# EAGLE schematic LightTable_Borders_CurrentMirror (EAGLE 9.6.2)
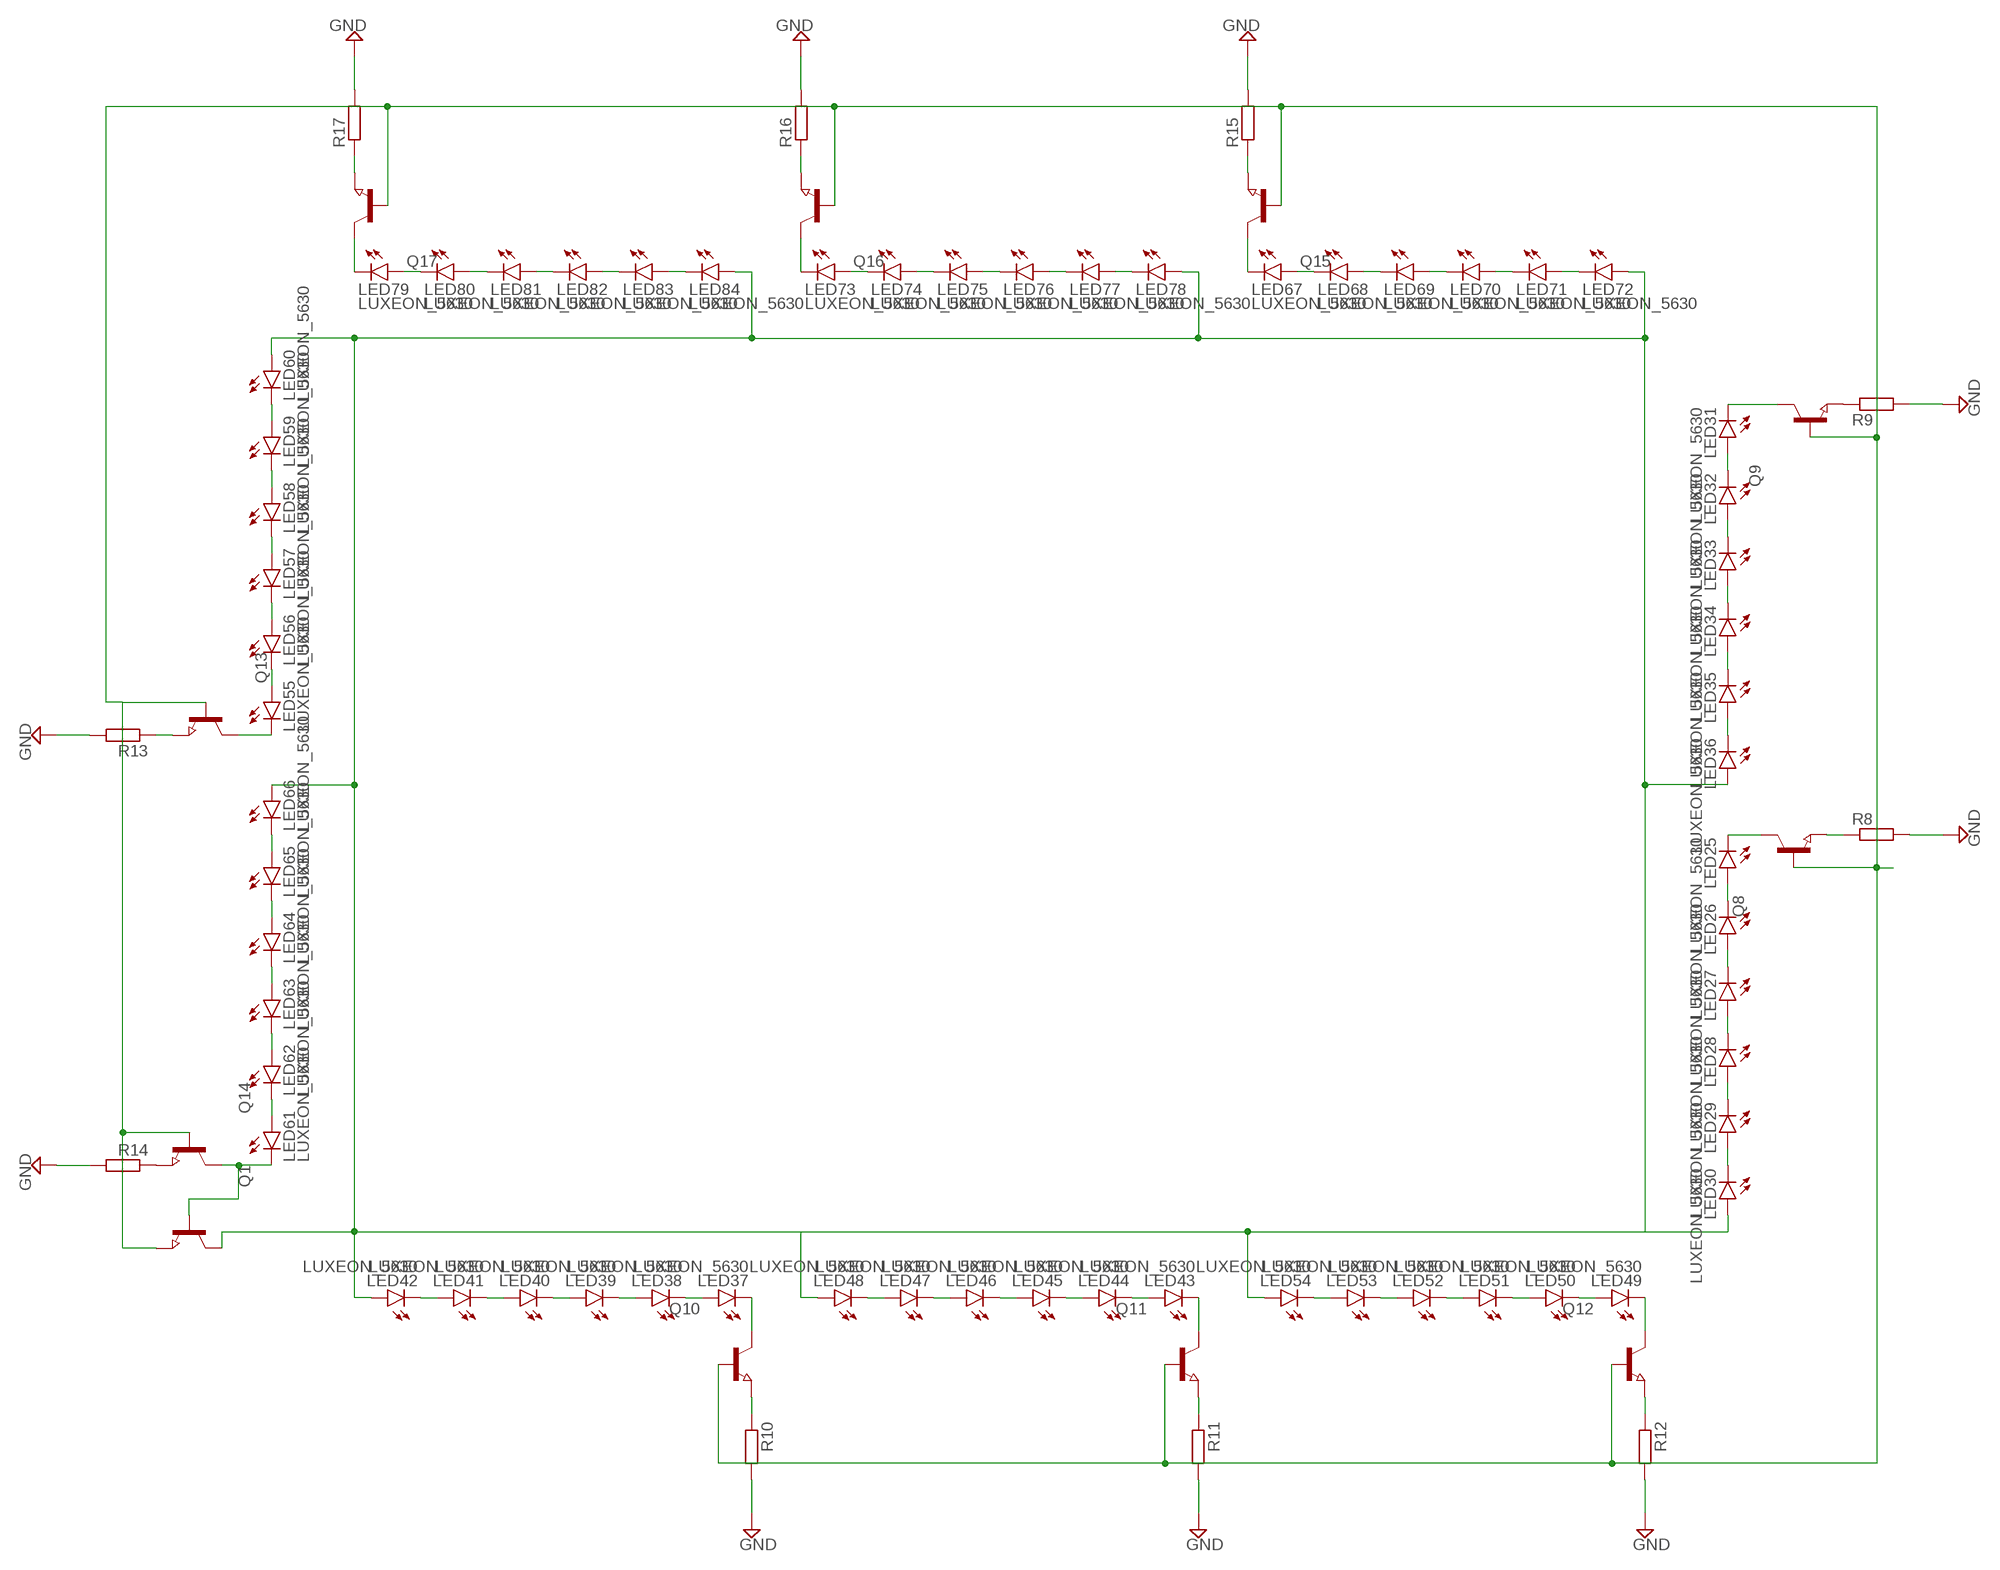
[diagram p0: schematic, sheet 1]

## Parts
LED25  LUXEON_5630  [LUXEON_5630]
LED26  LUXEON_5630  [LUXEON_5630]
LED27  LUXEON_5630  [LUXEON_5630]
LED28  LUXEON_5630  [LUXEON_5630]
LED29  LUXEON_5630  [LUXEON_5630]
LED30  LUXEON_5630  [LUXEON_5630]
LED31  LUXEON_5630  [LUXEON_5630]
LED32  LUXEON_5630  [LUXEON_5630]
LED33  LUXEON_5630  [LUXEON_5630]
LED34  LUXEON_5630  [LUXEON_5630]
LED35  LUXEON_5630  [LUXEON_5630]
LED36  LUXEON_5630  [LUXEON_5630]
LED37  LUXEON_5630  [LUXEON_5630]
LED38  LUXEON_5630  [LUXEON_5630]
LED39  LUXEON_5630  [LUXEON_5630]
LED40  LUXEON_5630  [LUXEON_5630]
LED41  LUXEON_5630  [LUXEON_5630]
LED42  LUXEON_5630  [LUXEON_5630]
LED43  LUXEON_5630  [LUXEON_5630]
LED44  LUXEON_5630  [LUXEON_5630]
LED45  LUXEON_5630  [LUXEON_5630]
LED46  LUXEON_5630  [LUXEON_5630]
LED47  LUXEON_5630  [LUXEON_5630]
LED48  LUXEON_5630  [LUXEON_5630]
LED49  LUXEON_5630  [LUXEON_5630]
LED50  LUXEON_5630  [LUXEON_5630]
LED51  LUXEON_5630  [LUXEON_5630]
LED52  LUXEON_5630  [LUXEON_5630]
LED53  LUXEON_5630  [LUXEON_5630]
LED54  LUXEON_5630  [LUXEON_5630]
LED55  LUXEON_5630  [LUXEON_5630]
LED56  LUXEON_5630  [LUXEON_5630]
LED57  LUXEON_5630  [LUXEON_5630]
LED58  LUXEON_5630  [LUXEON_5630]
LED59  LUXEON_5630  [LUXEON_5630]
LED60  LUXEON_5630  [LUXEON_5630]
LED61  LUXEON_5630  [LUXEON_5630]
LED62  LUXEON_5630  [LUXEON_5630]
LED63  LUXEON_5630  [LUXEON_5630]
LED64  LUXEON_5630  [LUXEON_5630]
LED65  LUXEON_5630  [LUXEON_5630]
LED66  LUXEON_5630  [LUXEON_5630]
LED67  LUXEON_5630  [LUXEON_5630]
LED68  LUXEON_5630  [LUXEON_5630]
LED69  LUXEON_5630  [LUXEON_5630]
LED70  LUXEON_5630  [LUXEON_5630]
LED71  LUXEON_5630  [LUXEON_5630]
LED72  LUXEON_5630  [LUXEON_5630]
LED73  LUXEON_5630  [LUXEON_5630]
LED74  LUXEON_5630  [LUXEON_5630]
LED75  LUXEON_5630  [LUXEON_5630]
LED76  LUXEON_5630  [LUXEON_5630]
LED77  LUXEON_5630  [LUXEON_5630]
LED78  LUXEON_5630  [LUXEON_5630]
LED79  LUXEON_5630  [LUXEON_5630]
LED80  LUXEON_5630  [LUXEON_5630]
LED81  LUXEON_5630  [LUXEON_5630]
LED82  LUXEON_5630  [LUXEON_5630]
LED83  LUXEON_5630  [LUXEON_5630]
LED84  LUXEON_5630  [LUXEON_5630]
Q1  NPN-TRANSISTOR_SOT23  [SOT23]
Q8  NPN-TRANSISTOR_SOT23  [SOT23]
Q9  NPN-TRANSISTOR_SOT23  [SOT23]
Q10  NPN-TRANSISTOR_SOT23  [SOT23]
Q11  NPN-TRANSISTOR_SOT23  [SOT23]
Q12  NPN-TRANSISTOR_SOT23  [SOT23]
Q13  NPN-TRANSISTOR_SOT23  [SOT23]
Q14  NPN-TRANSISTOR_SOT23  [SOT23]
Q15  NPN-TRANSISTOR_SOT23  [SOT23]
Q16  NPN-TRANSISTOR_SOT23  [SOT23]
Q17  NPN-TRANSISTOR_SOT23  [SOT23]
R8  R-EU_R0805  [R0805]
R9  R-EU_R0805  [R0805]
R10  R-EU_R0805  [R0805]
R11  R-EU_R0805  [R0805]
R12  R-EU_R0805  [R0805]
R13  R-EU_R0805  [R0805]
R14  R-EU_R0805  [R0805]
R15  R-EU_R0805  [R0805]
R16  R-EU_R0805  [R0805]
R17  R-EU_R0805  [R0805]

## Nets
GND: R8.2 R9.2 R10.2 R11.2 R12.2 R13.2 R14.2 R15.2 R16.2 R17.2
N$40: LED25.1@1(C) LED25.1@2(C) Q8.3(C)
N$41: LED25.2(A) LED26.1@1(C) LED26.1@2(C)
N$42: LED26.2(A) LED27.1@1(C) LED27.1@2(C)
N$43: Q8.2(E) R8.1
N$44: LED27.2(A) LED28.1@1(C) LED28.1@2(C)
N$45: LED28.2(A) LED29.1@1(C) LED29.1@2(C)
N$46: LED29.2(A) LED30.1@1(C) LED30.1@2(C)
N$48: LED31.1@1(C) LED31.1@2(C) Q9.3(C)
N$49: LED31.2(A) LED32.1@1(C) LED32.1@2(C)
N$50: LED32.2(A) LED33.1@1(C) LED33.1@2(C)
N$51: Q9.2(E) R9.1
N$52: LED33.2(A) LED34.1@1(C) LED34.1@2(C)
N$53: LED34.2(A) LED35.1@1(C) LED35.1@2(C)
N$54: LED35.2(A) LED36.1@1(C) LED36.1@2(C)
N$58: LED37.1@1(C) LED37.1@2(C) Q10.3(C)
N$59: LED37.2(A) LED38.1@1(C) LED38.1@2(C)
N$60: LED38.2(A) LED39.1@1(C) LED39.1@2(C)
N$61: Q10.2(E) R10.1
N$62: LED39.2(A) LED40.1@1(C) LED40.1@2(C)
N$63: LED40.2(A) LED41.1@1(C) LED41.1@2(C)
N$64: LED41.2(A) LED42.1@1(C) LED42.1@2(C)
N$67: LED43.1@1(C) LED43.1@2(C) Q11.3(C)
N$68: LED43.2(A) LED44.1@1(C) LED44.1@2(C)
N$69: LED44.2(A) LED45.1@1(C) LED45.1@2(C)
N$70: Q11.2(E) R11.1
N$71: LED45.2(A) LED46.1@1(C) LED46.1@2(C)
N$72: LED46.2(A) LED47.1@1(C) LED47.1@2(C)
N$73: LED47.2(A) LED48.1@1(C) LED48.1@2(C)
N$76: LED49.1@1(C) LED49.1@2(C) Q12.3(C)
N$77: LED49.2(A) LED50.1@1(C) LED50.1@2(C)
N$78: LED50.2(A) LED51.1@1(C) LED51.1@2(C)
N$79: Q12.2(E) R12.1
N$80: LED51.2(A) LED52.1@1(C) LED52.1@2(C)
N$81: LED52.2(A) LED53.1@1(C) LED53.1@2(C)
N$82: LED53.2(A) LED54.1@1(C) LED54.1@2(C)
N$85: LED55.1@1(C) LED55.1@2(C) Q13.3(C)
N$86: LED55.2(A) LED56.1@1(C) LED56.1@2(C)
N$87: LED56.2(A) LED57.1@1(C) LED57.1@2(C)
N$88: Q13.2(E) R13.1
N$89: LED57.2(A) LED58.1@1(C) LED58.1@2(C)
N$90: LED58.2(A) LED59.1@1(C) LED59.1@2(C)
N$91: LED59.2(A) LED60.1@1(C) LED60.1@2(C)
N$92: Q1.2(E) Q8.1(B) Q9.1(B) Q10.1(B) Q11.1(B) Q12.1(B) Q13.1(B) Q14.1(B) Q15.1(B) Q16.1(B) Q17.1(B)
N$93: LED61.1@1(C) LED61.1@2(C) Q1.1(B) Q14.3(C)
N$94: LED61.2(A) LED62.1@1(C) LED62.1@2(C)
N$95: LED62.2(A) LED63.1@1(C) LED63.1@2(C)
N$96: Q14.2(E) R14.1
N$97: LED63.2(A) LED64.1@1(C) LED64.1@2(C)
N$98: LED64.2(A) LED65.1@1(C) LED65.1@2(C)
N$99: LED65.2(A) LED66.1@1(C) LED66.1@2(C)
N$103: LED67.1@1(C) LED67.1@2(C) Q15.3(C)
N$104: LED67.2(A) LED68.1@1(C) LED68.1@2(C)
N$105: LED68.2(A) LED69.1@1(C) LED69.1@2(C)
N$106: Q15.2(E) R15.1
N$107: LED69.2(A) LED70.1@1(C) LED70.1@2(C)
N$108: LED70.2(A) LED71.1@1(C) LED71.1@2(C)
N$109: LED71.2(A) LED72.1@1(C) LED72.1@2(C)
N$112: LED73.1@1(C) LED73.1@2(C) Q16.3(C)
N$113: LED73.2(A) LED74.1@1(C) LED74.1@2(C)
N$114: LED74.2(A) LED75.1@1(C) LED75.1@2(C)
N$115: Q16.2(E) R16.1
N$116: LED75.2(A) LED76.1@1(C) LED76.1@2(C)
N$117: LED76.2(A) LED77.1@1(C) LED77.1@2(C)
N$118: LED77.2(A) LED78.1@1(C) LED78.1@2(C)
N$121: LED79.1@1(C) LED79.1@2(C) Q17.3(C)
N$122: LED79.2(A) LED80.1@1(C) LED80.1@2(C)
N$123: LED80.2(A) LED81.1@1(C) LED81.1@2(C)
N$124: Q17.2(E) R17.1
N$125: LED81.2(A) LED82.1@1(C) LED82.1@2(C)
N$126: LED82.2(A) LED83.1@1(C) LED83.1@2(C)
N$127: LED83.2(A) LED84.1@1(C) LED84.1@2(C)
N$128: LED30.2(A) LED36.2(A) LED42.2(A) LED48.2(A) LED54.2(A) LED60.2(A) LED66.2(A) LED72.2(A) LED78.2(A) LED84.2(A) Q1.3(C)

## Library data of the parts
LED25-LED84 = led:LUXEON_5630: LUXEON 5630 Mid-Power LEDs SD201 Source: Data sheet <www.philipslumileds.com/uploads/351/DS201-pdf> Lumileds 5630 Datasheet DS201 20130228 ©2013 Philips Lumileds Lighting Company.
Q1 Q8-Q17 = semicon-smd-ipc:NPN-TRANSISTOR_: NPN TRANSISTOR
R8-R17 = rcl:R-EU_: RESISTOR, European symbol; SPICEPREFIX: R